# EAGLE design pitanie (EAGLE 9.4.2)
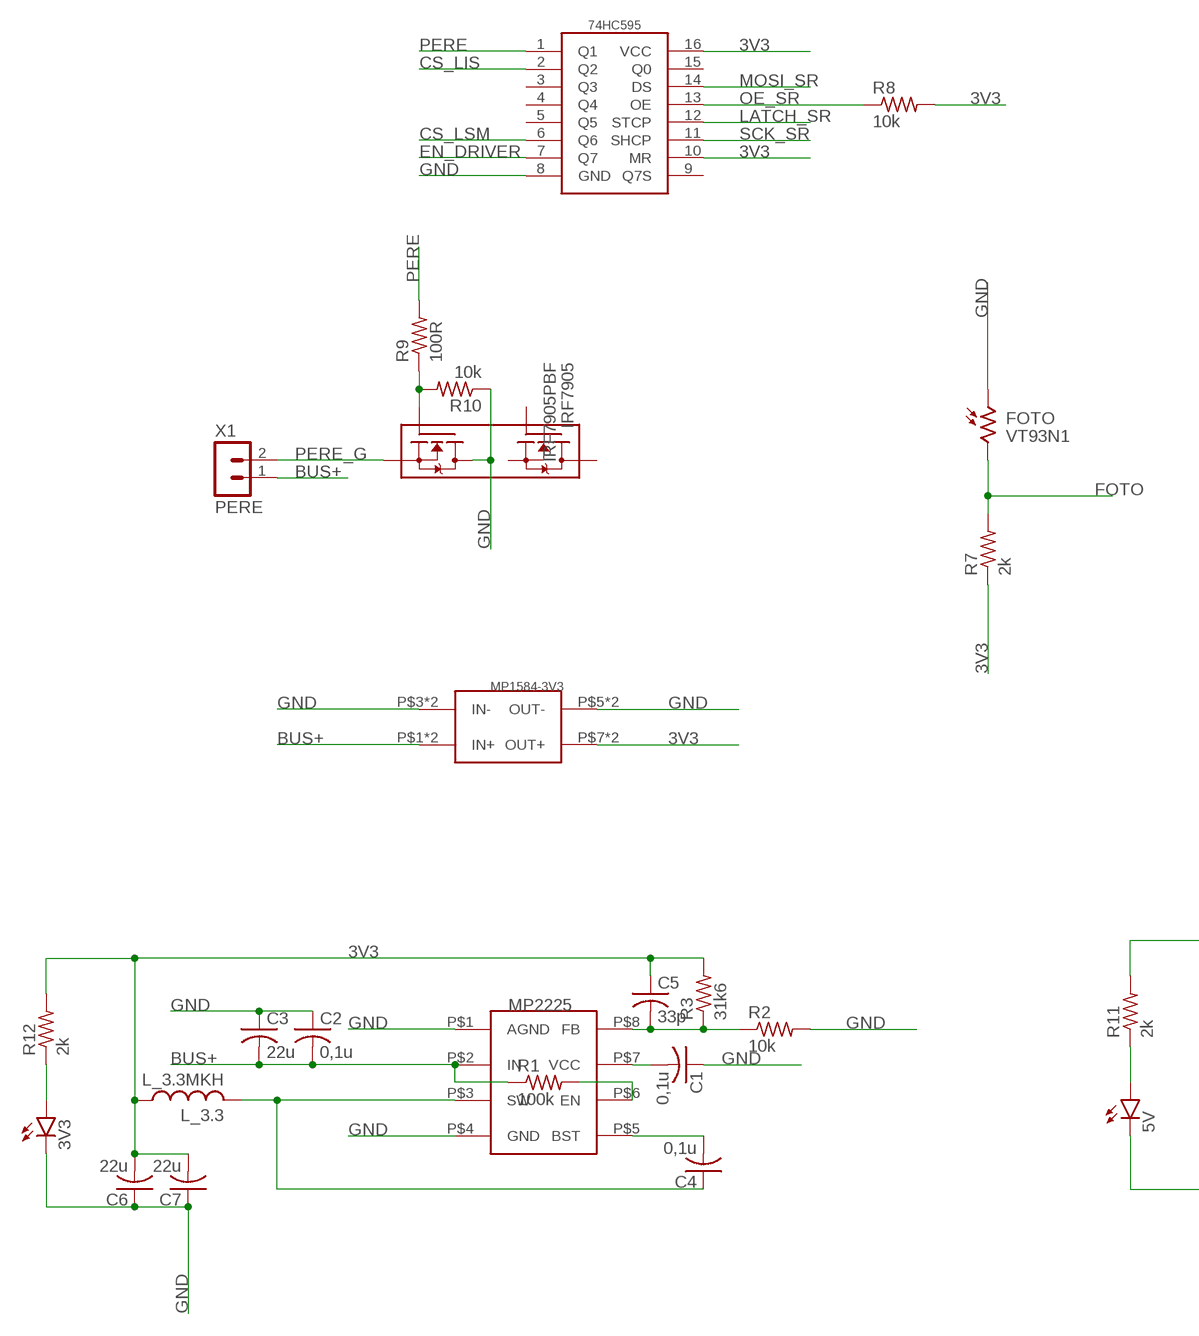
[diagram p0: schematic, sheet 1, part 1 of 2]
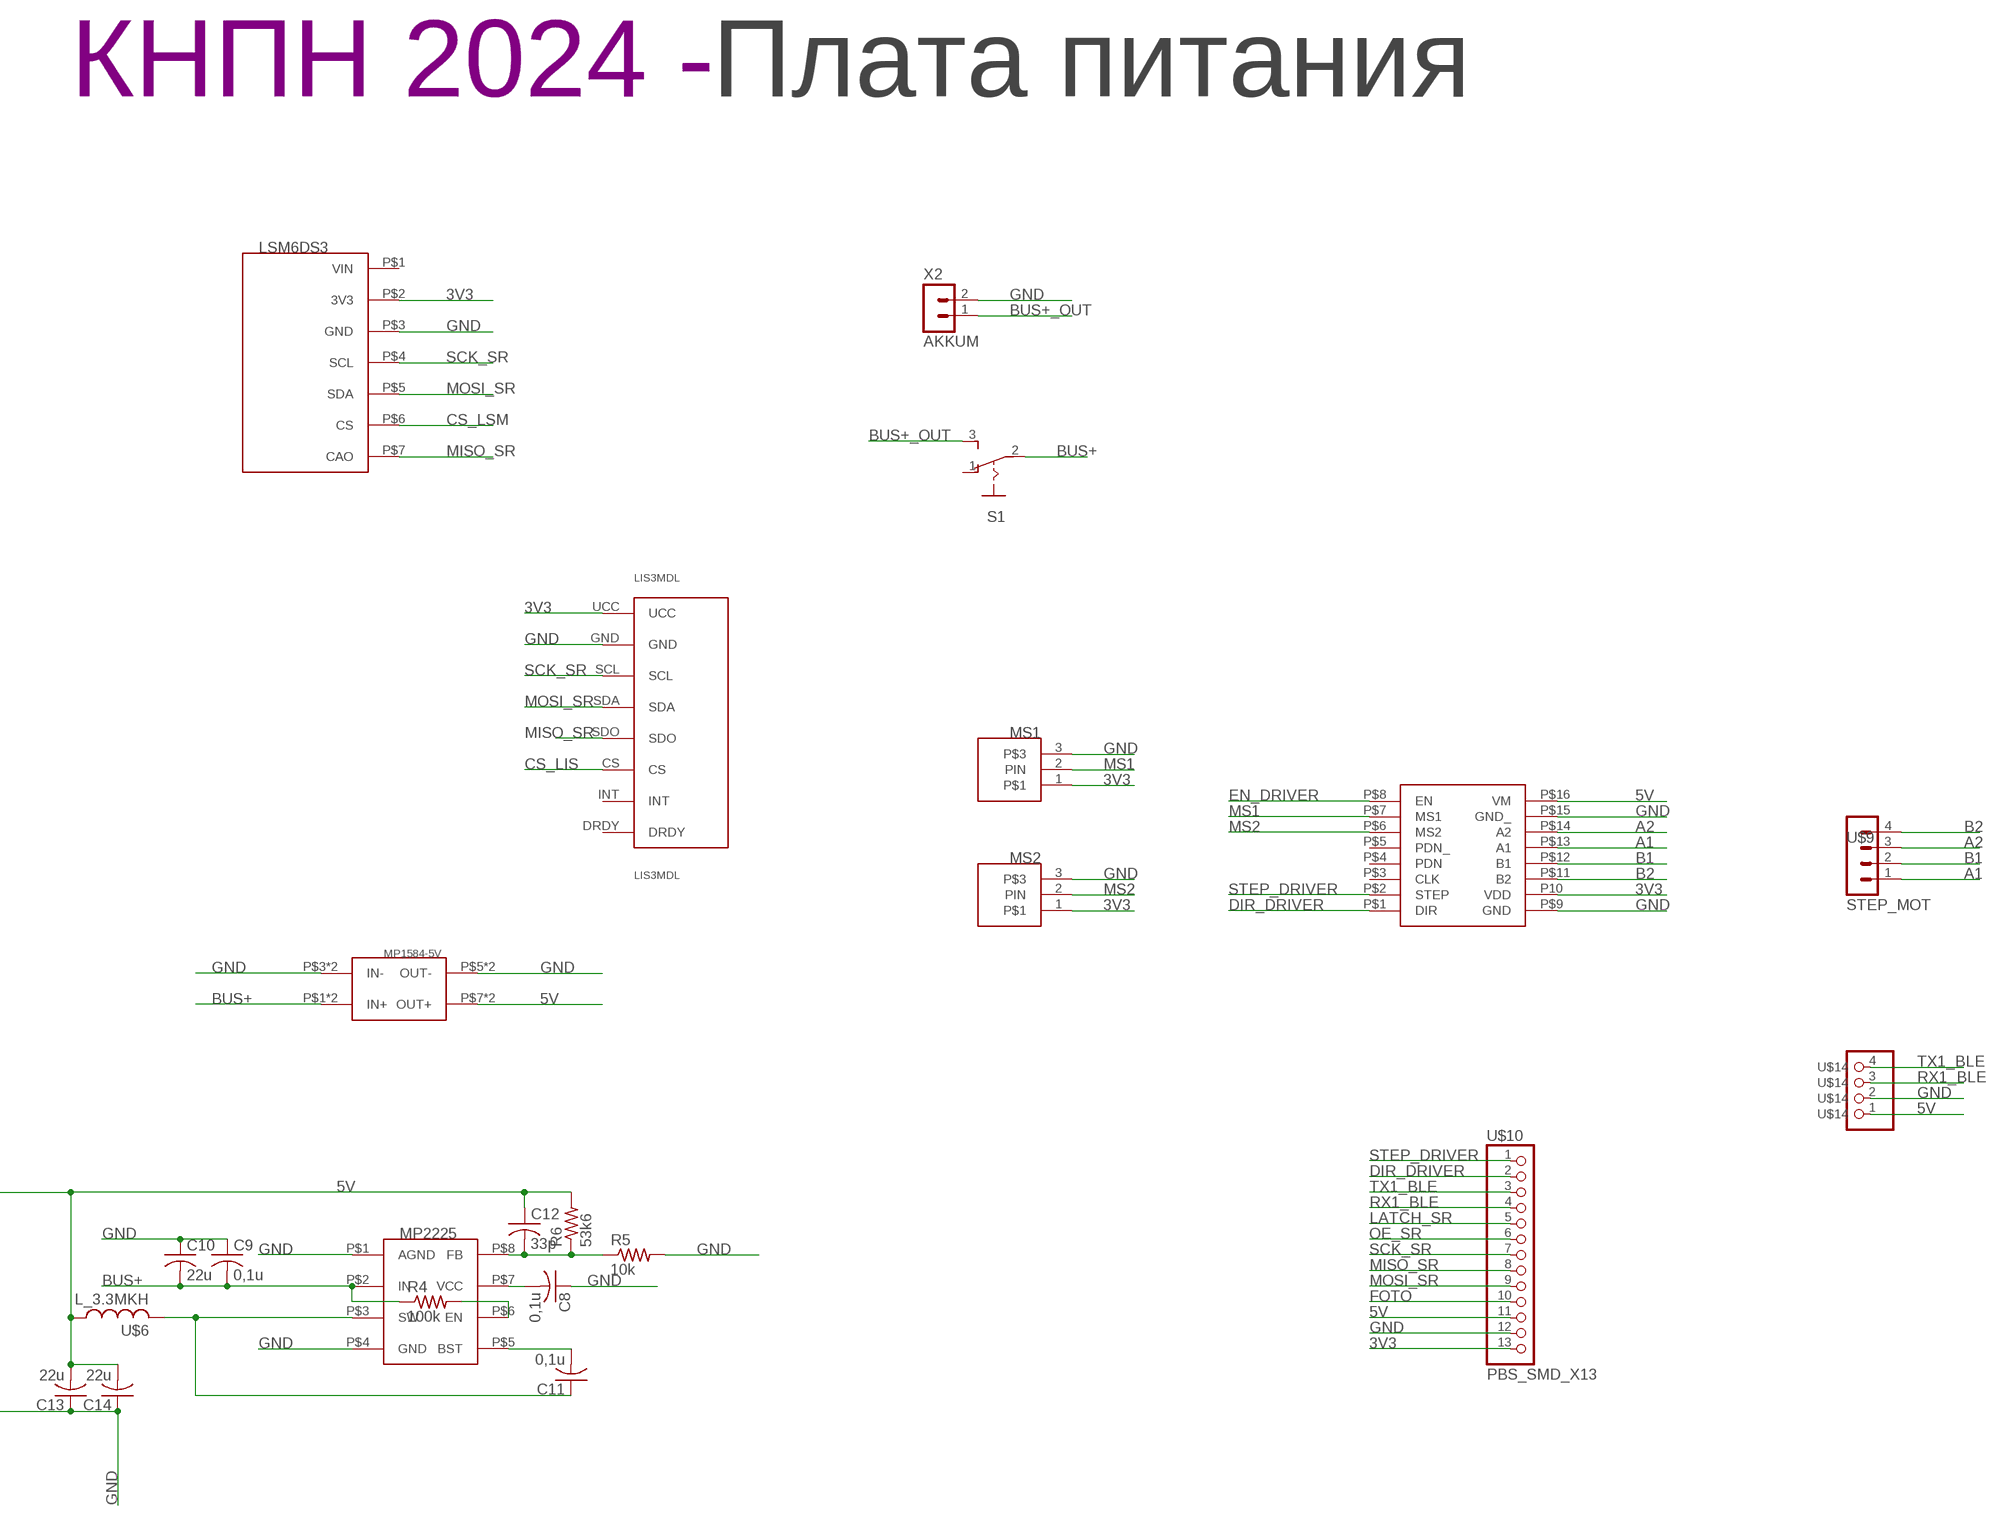
[diagram p1: schematic, sheet 1, part 2 of 2]

## Parts
3V3  LEDCHIP-LED0603  [CHIP-LED0603]
5V  LEDCHIP-LED0603  [CHIP-LED0603]
74HC595  74HC595  [TSSOP16]
C1  0,1u  C-USC0603  [C0603]
C2  0,1u  C-USC1206  [C1206]
C3  22u  C-USC0603  [C0603]
C4  0,1u  C-USC0603  [C0603]
C5  33p  C-USC0603  [C0603]
C6  22u  C-USC1206  [C1206]
C7  22u  C-USC1206  [C1206]
C8  0,1u  C-USC0603  [C0603]
C9  0,1u  C-USC1206  [C1206]
C10  22u  C-USC0603  [C0603]
C11  0,1u  C-USC0603  [C0603]
C12  33p  C-USC0603  [C0603]
C13  22u  C-USC1206  [C1206]
C14  22u  C-USC1206  [C1206]
DRIVER  TMC2209_WITHOUT  [TMC2209_WITHOUT]
FOTO  VT93N1  [VT93N1]
IRF7905  IRF7905PBF  [SO8]
L_3.3  L_3.3MKH  L_3.3MKH_5X5  [L_SPM5020]
LIS3MDL  LIS3MDL  [LIS3MDL]
LSM6DS3  LSM6DS3_WITHOUT  [LSM6DS3_WITHOUT]
MP1584-3V3  MP1584-B  [MP1584-B]
MP1584-5V  MP1584  MP1584-B  [MP1584-B]
MS1  CONNECT_3  [CONNECT_3]
MS2  CONNECT_3  [CONNECT_3]
R1  100k  R-US_R0603  [R0603]
R2  10k  R-US_R0603  [R0603]
R3  31k6  R-US_R0603  [R0603]
R4  100k  R-US_R0603  [R0603]
R5  10k  R-US_R0603  [R0603]
R6  53k6  R-US_R0603  [R0603]
R7  2k  R-US_R0603  [R0603]
R8  10k  R-US_R0603  [R0603]
R9  100R  R-US_R0603  [R0603]
R10  10k  R-US_R0603  [R0603]
R11  2k  R-US_R0603  [R0603]
R12  2k  R-US_R0603  [R0603]
S1  UNICS-SWITCHSS_12D11  [SS_12D11]
U$1  Плата питания  LOGOPCB-""  [LOGO]
U$2  MP2225  [TSOT23-8]
U$5  MP2225  [TSOT23-8]
U$6  L_3.3MKH  L_3.3MKH_5X5  [L_SPM5020]
U$9  STEP_MOT  JST-4-2.5  [JST-4-2.5]
U$10  PBS_SMD_X13  [PBD_SMD_X13]
U$14  BLUETOOTH  MOLEX-4-1.25  [53047-04]
X1  PERE  JST-2-2.5  [JST-2-2.5]
X2  AKKUM  JST-2-2.5  [JST-2-2.5]

## Nets
3V3: 74HC595.10(MR) 74HC595.16(VCC) C5.1 C6.2 C7.2 DRIVER.P10(VDD) L_3.3.P$1 LIS3MDL.UCC LSM6DS3.P$2(3V3) MP1584-3V3.P$7(OUT+) MP1584-3V3.P$8(OUT+) MS1.1 MS2.1 R3.2 R7.1 R8.2 R12.2 U$10.13
5V: C12.1 C13.2 C14.2 DRIVER.P$16(VM) MP1584-5V.P$7(OUT+) MP1584-5V.P$8(OUT+) R6.2 R11.2 U$6.P$1 U$10.11 U$14.1
A1: DRIVER.P$13(A1) U$9.1
A2: DRIVER.P$14(A2) U$9.3
B1: DRIVER.P$12(B1) U$9.2
B2: DRIVER.P$11(B2) U$9.4
BUS+: C2.2 C3.2 C9.2 C10.2 MP1584-3V3.P$1(IN+) MP1584-3V3.P$2(IN+) MP1584-5V.P$1(IN+) MP1584-5V.P$2(IN+) R1.1 R4.1 S1.2(P) U$2.P$2(IN) U$5.P$2(IN) X1.1
BUS+_OUT: S1.3(S) X2.1
CS_LIS: 74HC595.2(Q2) LIS3MDL.CS
CS_LSM: 74HC595.6(Q6) LSM6DS3.P$6(CS)
DIR_DRIVER: DRIVER.P$1(DIR) U$10.2
EN_DRIVER: 74HC595.7(Q7) DRIVER.P$8(EN)
FOTO: FOTO.P$2 R7.2 U$10.10
GND: 3V3.C 5V.C 74HC595.8(GND) C1.1 C2.1 C3.1 C6.1 C7.1 C8.1 C9.1 C10.1 C13.1 C14.1 DRIVER.P$9(GND) DRIVER.P$15(GND_) FOTO.P$1 IRF7905.7(D2) IRF7905.8(D2) LIS3MDL.GND LSM6DS3.P$3(GND) MP1584-3V3.P$3(IN-) MP1584-3V3.P$4(IN-) MP1584-3V3.P$5(OUT-) MP1584-3V3.P$6(OUT-) MP1584-5V.P$3(IN-) MP1584-5V.P$4(IN-) MP1584-5V.P$5(OUT-) MP1584-5V.P$6(OUT-) MS1.3 MS2.3 R2.2 R5.2 R10.1 U$2.P$1(AGND) U$2.P$4(GND) U$5.P$1(AGND) U$5.P$4(GND) U$10.12 U$14.2 X2.2
LATCH_SR: 74HC595.12(STCP) U$10.5
MISO_SR: LIS3MDL.SDO LSM6DS3.P$7(CAO) U$10.8
MOSI_SR: 74HC595.14(DS) LIS3MDL.SDA LSM6DS3.P$5(SDA) U$10.9
MS1: DRIVER.P$7(MS1) MS1.2(PIN)
MS2: DRIVER.P$6(MS2) MS2.2(PIN)
N$1: C1.2 U$2.P$7(VCC)
N$2: R1.2 U$2.P$6(EN)
N$3: C4.2 U$2.P$5(BST)
N$4: C4.1 L_3.3.P$2 U$2.P$3(SW)
N$5: C5.2 R2.1 R3.1 U$2.P$8(FB)
N$6: IRF7905.2(G2) R9.1 R10.2
N$7: C8.2 U$5.P$7(VCC)
N$8: R4.2 U$5.P$6(EN)
N$9: C11.2 U$5.P$5(BST)
N$10: C11.1 U$5.P$3(SW) U$6.P$2
N$11: C12.2 R5.1 R6.1 U$5.P$8(FB)
N$12: 5V.A R11.1
N$13: 3V3.A R12.1
OE_SR: 74HC595.13(OE) R8.1 U$10.6
PERE: 74HC595.1(Q1) R9.2
PERE_G: IRF7905.1(S2) X1.2
RX1_BLE: U$10.4 U$14.3
SCK_SR: 74HC595.11(SHCP) LIS3MDL.SCL LSM6DS3.P$4(SCL) U$10.7
STEP_DRIVER: DRIVER.P$2(STEP) U$10.1
TX1_BLE: U$10.3 U$14.4
Unconnected: 74HC595.3(Q3) 74HC595.4(Q4) 74HC595.5(Q5) 74HC595.9(Q7S) 74HC595.15(Q0) DRIVER.P$3(CLK) DRIVER.P$4(PDN) DRIVER.P$5(PDN_) IRF7905.3(S1) IRF7905.4(G1) IRF7905.5(D1) IRF7905.6(D1) LIS3MDL.DRDY LIS3MDL.INT LSM6DS3.P$1(VIN) S1.1(O)

## Library data of the parts
3V3 5V = led:LED: LED OSRAM: - CHIPLED LG R971, LG N971, LY N971, LG Q971, LY Q971, LO R971, LY R971 LH N974, LH R974 LS Q976, LO Q976, LY Q976 LO Q996 - Hyper CHIPLED LW Q18S LB Q993, LB Q99A, LB R99A - SideLED LS A670, LO A670, LY A670, LG A670, LP A670 LB A673, LV A673, LT A673, LW A673 LH A674 LY A675 LS A676, LA A676, LO A676, LY A676, LW A676 LS A679, LY A679, LG A679 - Hyper Micro SIDELED® LS Y876, LA Y876, LO Y876, LY Y876 LT Y87S - SmartLED LW L88C, LW L88S LB L89C, LB L89S, LG L890 LS L89K, LO L89K, LY L89K LS L896, LA L896, LO L896, LY L896 - TOPLED LS T670, LO T670, LY T670, LG T670, LP T670 LSG T670, LSP T670, LSY T670, LOP T670, LYG T670 LG T671, LOG T671, LSG T671 LB T673, LV T673, LT T673, LW T673 LH T674 LS T676, LA T676, LO T676, LY T676, LB T676, LH T676, LSB T676, LW T676 LB T67C, LV T67C, LT T67C, LS T67K, LO T67K, LY T67K, LW E67C LS E67B, LA E67B, LO E67B, LY E67B, LB E67C, LV E67C, LT E67C LW T67C LS T679, LY T679, LG T679 LS T770, LO T770, LY T770, LG T770, LP T770 LB T773, LV T773, LT T773, LW T773 LH T774 LS E675, LA E675, LY E675, LS T675 LS T776, LA T776, LO T776, LY T776, LB T776 LHGB T686 LT T68C, LB T68C - Hyper Mini TOPLED® LB M676 - Mini TOPLED Santana® LG M470 LS M47K, LO M47K, LY M47K Source: http://www.osram.convergy.de LUXEON: - LUMILED® LXK2-PW12-R00, LXK2-PW12-S00, LXK2-PW14-U00, LXK2-PW14-V00 LXK2-PM12-R00, LXK2-PM12-S00, LXK2-PM14-U00 LXK2-PE12-Q00, LXK2-PE12-R00, LXK2-PE12-S00, LXK2-PE14-T00, LXK2-PE14-U00 LXK2-PB12-K00, LXK2-PB12-L00, LXK2-PB12-M00, LXK2-PB14-N00, LXK2-PB14-P00, LXK2-PB14-Q00 LXK2-PR12-L00, LXK2-PR12-M00, LXK2-PR14-Q00, LXK2-PR14-R00 LXK2-PD12-Q00, LXK2-PD12-R00, LXK2-PD12-S00 LXK2-PH12-R00, LXK2-PH12-S00 LXK2-PL12-P00, LXK2-PL12-Q00, LXK2-PL12-R00 Source: www.luxeon.com KINGBRIGHT: KA-3528ASYC Source: www.kingbright.com
74HC595 = UNKNOWN-2024:74HC595
C1-C14 = rcl:C-US: CAPACITOR, American symbol; SPICEPREFIX: C
DRIVER = UNKNOWN-2024:TMC2209_WITHOUT
FOTO = KNPN-2023:VT93N1
IRF7905 = UNKNOWN-2024:IRF7905PBF
L_3.3 U$6 = CanCubeSat:L_3.3MKH_5X5
LIS3MDL = UNKNOWN-2024:LIS3MDL
LSM6DS3 = UNKNOWN-2024:LSM6DS3_WITHOUT
MP1584-3V3 MP1584-5V = UNKNOWN-2024:MP1584-B
MS1 MS2 = UNKNOWN-2024:CONNECT_3
R1-R12 = rcl:R-US_: RESISTOR, American symbol; SPICEPREFIX: R
S1 = UNKNOWN-2024:UNICS-SWITCH: SLIDING SWITCH Distributor Buerklin, 11G810
U$1 = UNKNOWN-2024:LOGO
U$2 U$5 = UNKNOWN-2024:MP2225
U$9 = UNKNOWN-2024:JST-4-2.5
U$10 = UNKNOWN-2024:PBS_SMD_X13
U$14 = UNKNOWN-2024:MOLEX-4-1.25
X1 X2 = UNKNOWN-2024:JST-2-2.5: JST PH series header 2.00mm pitch disconnectable crimp style connectors, vertical (side entry type), 2 pins

## Board
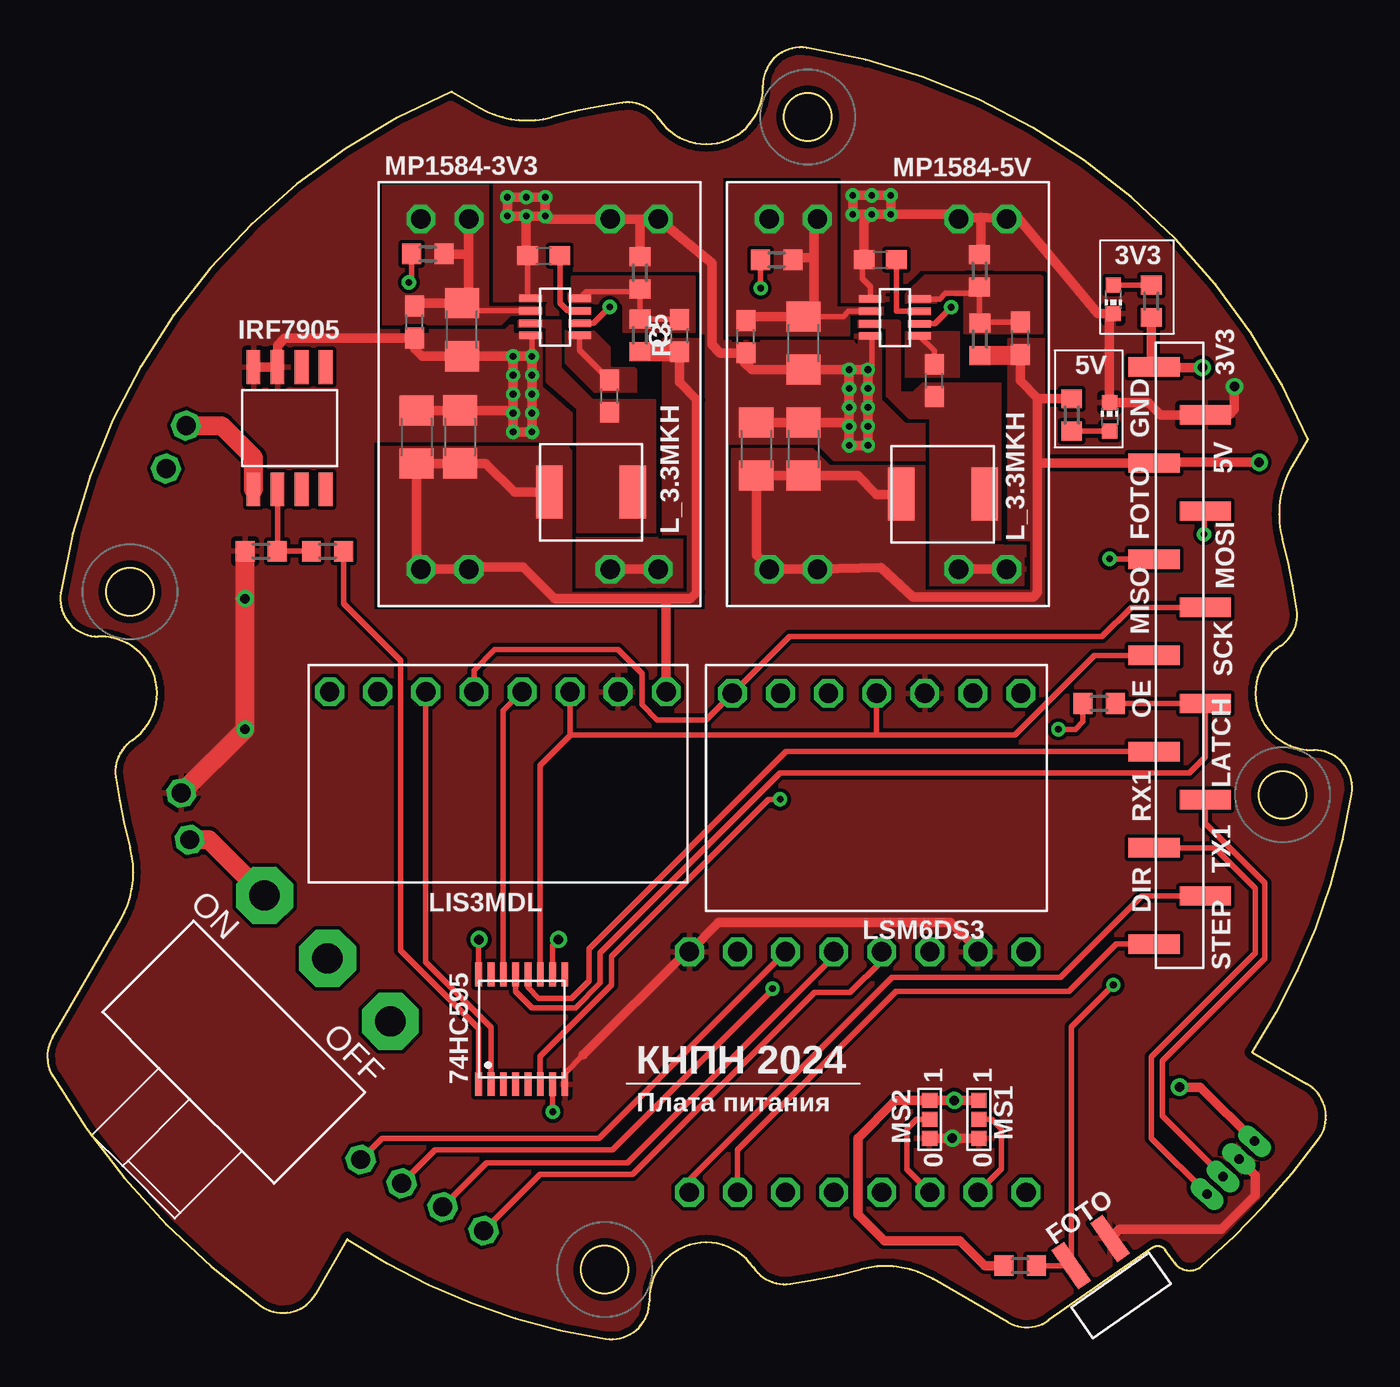
[diagram p2: board, top side]
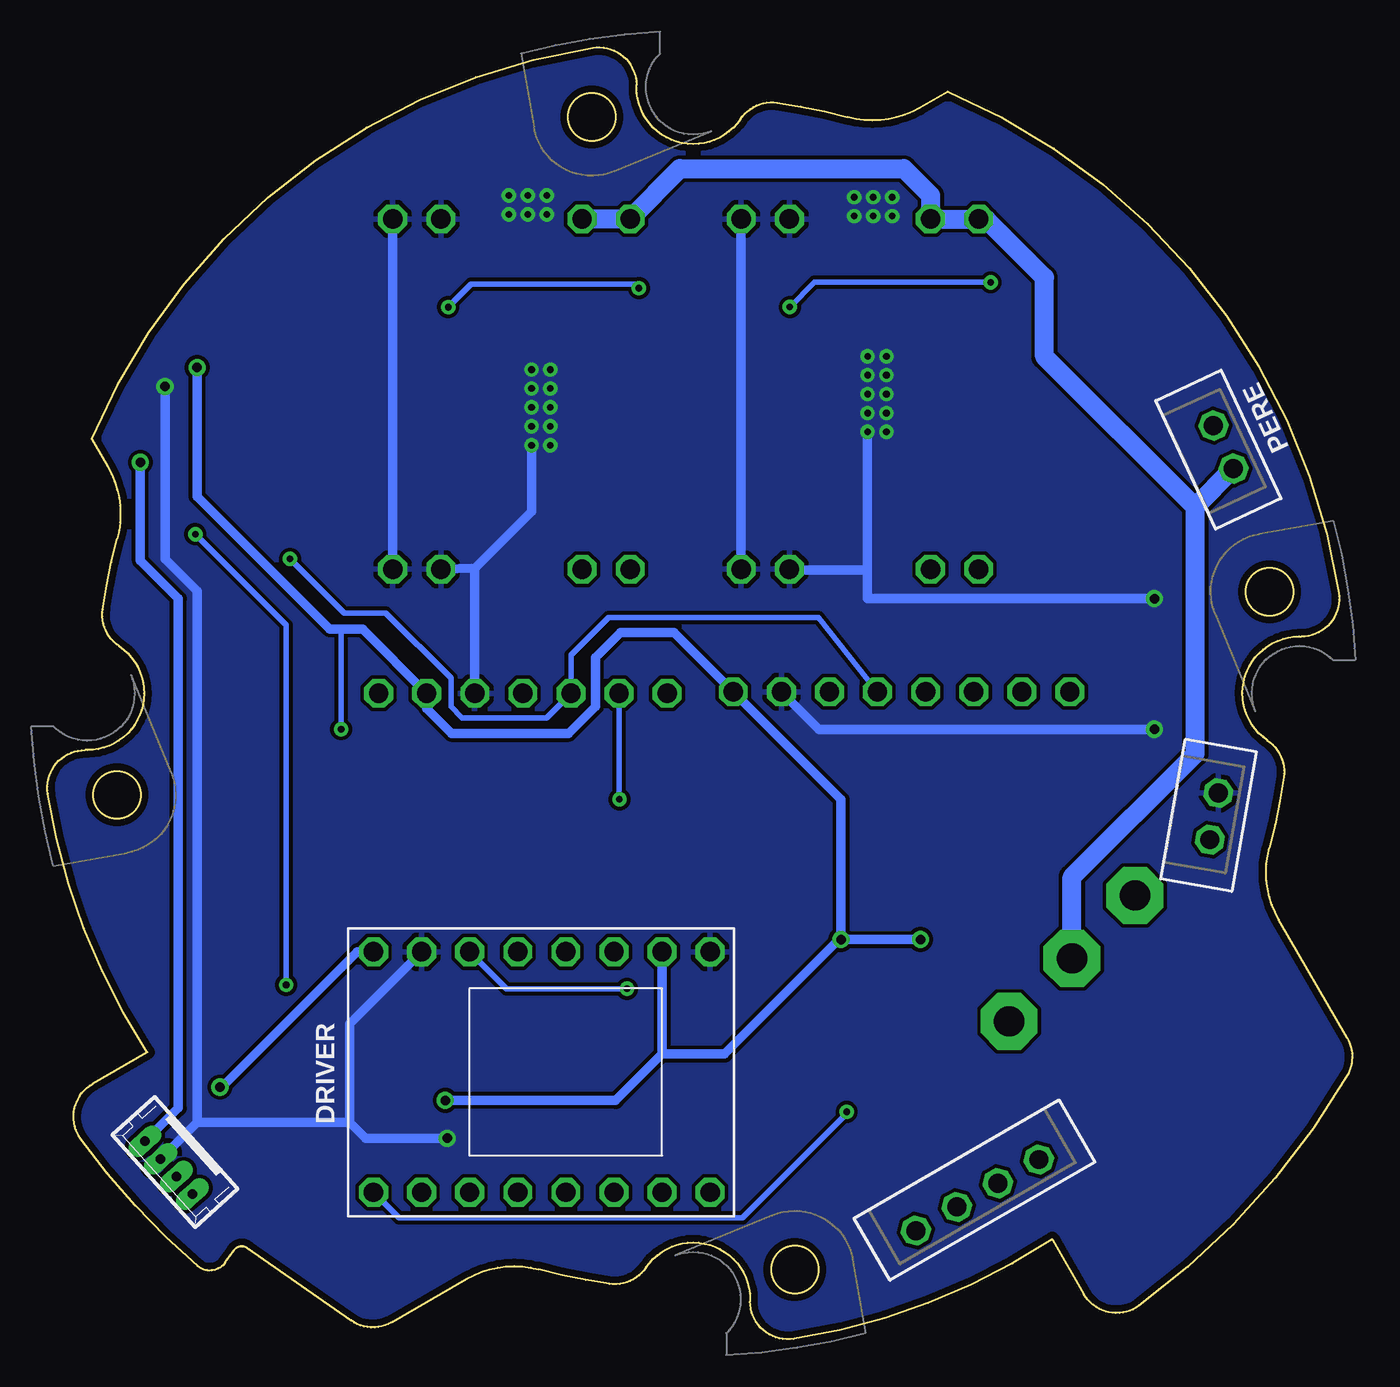
[diagram p3: board, bottom side, seen from below]

Size 68.9 x 68.22 mm. Coordinates in mm from the lower left corner, seen from the top.
Outline: 0.27,15.91 3.87,22.15 arc45 4.37,25.95 arc-7 3.61,29.68 arc-64 4.47,31.62 arc146 2.79,37.11 2.68,37.11 arc-99 0.7,39.42 arc-58 21.36,65.89 22.83,65.03 arc45 26.63,64.54 arc-7 30.37,65.3 arc-64 32.31,64.44 arc146 37.79,66.11 37.79,66.22 arc-99 40.1,68.2 arc-58 66.57,47.55 65.72,46.07 arc45 65.22,42.28 arc-7 65.98,38.54 arc-64 65.12,36.6 arc146 66.79,31.11 66.91,31.11 arc-99 68.88,28.8 arc-24 63.62,15.16 66.52,13.48 arc-96 67.14,10.58 arc-13 60.98,3.87 arc-96 59.5,4.05 59.05,4.7 arc90 58.35,4.83 52.87,0.99 arc-65 50.72,0.9 46.75,3.19 arc45 42.96,3.69 arc-7 39.22,2.92 arc-64 37.28,3.79 arc146 31.79,2.11 31.79,2 arc-99 29.49,0.02 arc-24 15.84,5.28 14.17,2.39 arc-96 11.26,1.77 arc-24 0.27,13.9 arc-60 0.27,15.91
Outline: circle at 29.43,3.68 radius 1.25
Outline: circle at 4.36,39.48 radius 1.25
Outline: circle at 65.22,28.75 radius 1.25
Outline: circle at 40.16,64.54 radius 1.25
Copper layers (1*16): Top 0.035mm / dielectric 1.5mm / Bottom 0.035mm
Design rules "default *": minimum track width 0.3mm, minimum drill 0.35mm, track to track 0.2mm, track to pad 0.2mm, pad to pad 0.2mm, via to via 0.2mm, smd to smd 0.2mm, copper to edge 0.35mm, drill to drill 0.2mm, minimum pad ring 10mil, minimum via ring 8mil, stop-mask expansion 4mil, vias tented up to drill 0mil, thermal gap 10mil

### Footprints (pad centres in the part's own frame; a part is rotated, then mirrored left to right if it is on the bottom)
CHIP-LED0603 = smd 0.8 x 0.8: A 0,-0.75; C 0,0.75
TSSOP16 = smd 1.26 x 0.36: 1 -2.9,2.275; 2 -2.9,1.625; 3 -2.9,0.975; 4 -2.9,0.325; 5 -2.9,-0.325; 6 -2.9,-0.975; 7 -2.9,-1.625; 8 -2.9,-2.275; 9 2.9,-2.275; 10 2.9,-1.625; 11 2.9,-0.975; 12 2.9,-0.325; 13 2.9,0.325; 14 2.9,0.975; 15 2.9,1.625; 16 2.9,2.275
C0603 = smd 1.1 x 1: 1 -0.85,0; 2 0.85,0
C1206 = smd 1.6 x 1.8: 1 -1.4,0; 2 1.4,0
TMC2209_WITHOUT = drill 1.016 octagon: P10 6.35,-6.35; P$1 -6.35,-8.89; P$2 -6.35,-6.35; P$3 -6.35,-3.81; P$4 -6.35,-1.27; P$5 -6.35,1.27; P$6 -6.35,3.81; P$7 -6.35,6.35; P$8 -6.35,8.89; P$9 6.35,-8.89; P$11 6.35,-3.81; P$12 6.35,-1.27; P$13 6.35,1.27; P$14 6.35,3.81; P$15 6.35,6.35; P$16 6.35,8.89
VT93N1 = smd 0.8 x 2.5: P$1 -1.25,-1.8; P$2 1.25,-1.8
SO8 = smd 0.72 x 1.78: 1 -1.905,-3.23; 2 -0.635,-3.23; 3 0.635,-3.23; 4 1.905,-3.23; 5 1.905,3.23; 6 0.635,3.23; 7 -0.635,3.23; 8 -1.905,3.23
L_SPM5020 = smd 1.4 x 2.8: P$1 -2.2,0; P$2 2.2,0
LIS3MDL = drill 1.016 octagon: CS -5.08,-3.81; DRDY -5.08,-8.89; GND -5.08,6.35; INT -5.08,-6.35; SCL -5.08,3.81; SDA -5.08,1.27; SDO -5.08,-1.27; UCC -5.08,8.89
LSM6DS3_WITHOUT = drill 1.016 octagon: P$1 -7.62,-5; P$2 -5.08,-5; P$3 -2.54,-5; P$4 0,-5; P$5 2.54,-5; P$6 5.08,-5; P$7 7.62,-5
MP1584-B = drill 1.016 octagon: P$1 -9.25,-6.27; P$2 -9.25,-3.73; P$3 -9.25,3.73; P$4 -9.25,6.27; P$5 9.25,6.27; P$6 9.25,3.73; P$7 9.25,-3.73; P$8 9.25,-6.27
CONNECT_3 = smd 0.8 x 0.8: 1 1,0; 2 0,0; 3 -1,0
R0603 = smd 1 x 1.1: 1 -0.85,0; 2 0.85,0
SS_12D11 = drill 1.6 pad 3 octagon: 1 -4.7,0; 2 0,0; 3 4.7,0
TSOT23-8 = smd 0.4 x 1.2: P$1 -0.975,-1.3; P$2 -0.325,-1.3; P$3 0.325,-1.3; P$4 0.975,-1.3; P$5 0.975,1.3; P$6 0.325,1.3; P$7 -0.325,1.3; P$8 -0.975,1.3
JST-4-2.5 = drill 1 pad 1.5 octagon: 1 3.75,0; 2 1.25,0; 3 -1.25,0; 4 -3.75,0
PBD_SMD_X13 = smd 1.02 x 2.7: 1 -15.24,1.35; 2 -12.7,-1.35; 3 -10.16,1.35; 4 -7.62,-1.35; 5 -5.08,1.35; 6 -2.54,-1.35; 7 0,1.35; 8 2.54,-1.35; 9 5.08,1.35; 10 7.62,-1.35; 11 10.16,1.35; 12 12.7,-1.35; 13 15.24,1.35
53047-04 = drill 0.5 pad 0.698 long: 1 1.875,0.45; 2 0.625,0.45; 3 -0.625,0.45; 4 -1.875,0.45
JST-2-2.5 = drill 1 pad 1.5 octagon: 1 1.25,0; 2 -1.25,0

### Placement (x,y rotation side)
3V3  56.29,54.91 180 top
5V  56.09,48.71 0 top
74HC595  25.05,16.37 90 top
C1  26.21,57.21 0 top
C2  21.89,53.31 90 top
C3  19.39,53.71 90 top
C4  29.69,49.8 90 top
C5  33.39,52.99 90 top
C6  19.49,47.64 270 top
C7  21.79,47.65 270 top
C8  43.99,57.01 0 top
C9  39.94,52.61 90 top
C10  36.89,52.94 90 top
C11  46.84,50.64 90 top
C12  51.39,52.86 90 top
C13  37.44,47.01 270 top
C14  39.94,47.01 270 top
DRIVER  42.79,14.11 90 bottom
FOTO  56.12,3.13 215 top
IRF7905  12.79,48.11 0 top
L_3.3  28.71,44.73 0 top
LIS3MDL  23.79,29.11 270 top
LSM6DS3  43.79,29.11 180 top
MP1584-3V3  25.99,49.91 270 top
MP1584-5V  44.39,49.91 270 top
MS1  49.19,11.61 90 top
MS2  46.59,11.61 90 top
R1  20.09,57.31 180 top
R2  31.29,56.31 90 top
R3  31.29,53.01 270 top
R4  38.52,57 180 top
R5  49.23,56.42 90 top
R6  49.25,52.81 270 top
R7  51.37,3.89 0 top
R8  55.54,33.57 180 top
R9  14.79,41.61 0 top
R10  11.29,41.61 0 top
R11  54.09,48.81 90 top
R12  58.29,54.81 270 top
S1  14.79,20.11 135 top
U$1  30.59,13.51 0 top
U$2  26.81,53.98 270 top
U$5  44.76,53.96 270 top
U$6  47.29,44.63 0 top
U$9  19.79,7.61 210 bottom
U$10  59.79,36.11 90 top
U$14  62.17,9.36 132 bottom
X1  6.79,47.11 295 bottom
X2  7.29,27.61 260 bottom

### Tracks (layer width: path | path; a pad name or v marks a point on that pad's centre or on a via)
3V3  (via drill 0.35 pad 0.55, 0.5, 0.5 pad 0.55)
  Top 0.3: 33.37,52.16 C5.1 | 74HC595.16 22.78,21.1 v22.79,21.11 | 74HC595.10 26.68,20.8 v26.99,21.11 | R8.2 54.69,32.61 54.29,32.21 v53.39,32.21
  Top 0.5: L_3.3.P$1 24.67,44.73 23.15,46.25 C7.2 C6.2 | C6.2 | 32.69,39.11 26.79,39.11 25.12,40.78 22.41,40.78 MP1584-3V3.P$7 MP1584-3V3.P$8 19.5,40.84 C6.2 | 32.69,39.11 33.97,39.11 34.29,39.43 34.29,49.61 33.37,50.53 33.37,52.16 | v60.99,51.31 58.48,51.31 U$10.13 58.29,51.5 R12.2 | R7.1 49.51,3.89 48.19,5.21 44.19,5.21 42.8,6.61 42.8,10.61 44.79,12.61 MS2.1 v47.89,12.61 MS1.1 | LIS3MDL.UCC 32.68,39.1 32.69,39.11
  Top 1: R3.2 33.37,52.16
  Bottom 0.3: v53.39,32.21 53.39,37.51
  Bottom 0.5: v60.99,51.31 60.99,44.51 53.99,37.51 53.39,37.51 52.26,37.51 52.23,37.47 LSM6DS3.P$2 48.87,33.31 47.56,32 41.37,32 39.95,33.43 39.95,36.01 38.64,37.32 35.82,37.32 LIS3MDL.UCC 26.99,28.5 26.99,21.21 | v22.79,21.11 v26.99,21.11 26.99,21.21 | DRIVER.P10 36.44,15.06 | 36.44,15.06 38.89,12.61 v47.89,12.61 | 36.44,15.06 33.14,15.06 26.99,21.21
  pour Top (no thermals): 27.49,47.11 17.49,47.11 17.49,38.81 34.49,38.81 34.49,52.81 32.49,52.81 32.49,42.51 33.79,42.51 33.79,39.41 27.69,39.41 27.69,46.91
5V  (via drill 0.5 pad 0.55)
  Top 0.5: U$6.P$1 43.79,44.61 42.8,45.6 C14.2 C13.2 37.44,41.42 38.09,40.77 MP1584-5V.P$8 MP1584-5V.P$7 44.03,40.74 45.7,39.2 52.06,39.2 52.29,39.43 52.29,46.31 | 52.29,46.31 52.29,49.71 | C12.1 51.39,50.62 52.29,49.71 | 52.29,46.31 52.33,46.27 U$10.11 58.48,46.31 v63.99,46.31 | v59.79,13.31 60.9,13.31 U$14.1 | R11.2 52.34,49.66 52.29,49.71
  Top 1: C12.1 51.34,51.95 R6.2
  Bottom 0.5: U$14.1 61.99,12.22 61.99,39.11 63.99,41.11 v63.99,46.31 | v59.79,13.31 59.69,13.31 52.54,20.46 DRIVER.P$16
  pour Top (no thermals): 40.44,47.01 36.14,47.01 36.14,38.85 52.66,38.85 52.66,52.81 50.74,52.81 50.74,42.21 51.94,42.21 51.94,39.51 46.34,39.51 46.34,46.11 41.34,46.11
A1
  Top 0.3: U$9.1 26.02,8.71 30.92,8.71 40.52,18.31 42.39,18.31 44.06,19.98 DRIVER.P$13
A2  (via drill 0.35)
  Top 0.3: U$9.3 20.49,10.01 29.86,10.01 38.29,18.45 v38.29,18.51
  Bottom 0.3: v38.29,18.51 44.65,18.51 DRIVER.P$14
B1
  Top 0.3: U$9.2 23.2,9.31 30.63,9.31 41.52,20.2 DRIVER.P$12
B2
  Top 0.3: U$9.4 17.68,10.61 29.13,10.61 DRIVER.P$11
BUS+
  Top 0.3: U$5.P$2 42.31,54.28 42.04,54 C9.2 | U$2.P$2 22.3,54.31 C2.2
  Top 0.5: C3.2 19.54,54.71 C2.2 22.24,55.06 22.24,57.3 | MP1584-3V3.P$2 22.24,59.12 22.24,57.3 | R1.1 22.23,57.31 22.24,57.3 | C10.2 37.11,54 C9.2 40.49,54.55 40.49,57.11 | MP1584-5V.P$2 40.49,59.47 40.49,57.11 | R4.1 39.48,57.11 40.49,57.11
  Bottom 1: S1.2 14.79,24.41 8.29,30.91 8.29,43.95 | 8.29,43.95 X1.1 | MP1584-5V.P$2 MP1584-5V.P$1 35.51,61.83 23.68,61.83 22.25,60.4 MP1584-3V3.P$2 MP1584-3V3.P$1 19.31,59.13 16.24,56.06 16.24,51.9 8.29,43.95
  pour Top (no thermals): 23.29,60.91 17.69,60.91 17.69,53.61 23.99,53.61 24.49,54.11 26.09,54.11 26.09,54.51 23.29,54.51
  pour Top (no thermals): 44.14,54.51 44.14,54.11 42.34,54.11 42.34,53.01 35.94,53.01 35.94,61.11 41.64,61.11 41.64,54.51
BUS+_OUT
  Top 1: X2.1 8.52,26.38 S1.3
CS_LIS
  Top 0.3: 74HC595.2 23.43,16.48 19.98,19.92 LIS3MDL.CS
CS_LSM  (via drill 0.35)
  Top 0.3: 74HC595.6 26.03,14.95 28.09,17.01 28.11,17.01 29.8,18.7 29.8,20.22 38.09,28.51 v38.69,28.51
  Bottom 0.3: LSM6DS3.P$6 38.71,28.53 v38.69,28.51
DIR_DRIVER
  Top 0.3: U$10.2 57.79,23.41 53.49,19.11 44.59,19.11 33.9,8.42 DRIVER.P$1
EN_DRIVER  (via drill 0.35)
  Top 0.3: v26.69,12.01 26.68,12.03 74HC595.7
  Bottom 0.3: DRIVER.P$8 50.33,6.41 32.19,6.41 26.69,11.91 v26.69,12.01
FOTO  (via drill 0.35)
  Top 0.3: R7.2 FOTO.P$2 54.07,16.49 v56.29,18.71 | U$10.10 61.09,43.68 v61.09,42.51
  Bottom 0.3: v56.29,18.71 56.29,37.71 v61.09,42.51
GND  (via drill 0.35, 0.5, 0.5 pad 0.55)
  Top 0.3: U$2.P$1 25.36,55.11 C1.1 | v43.34,51.2 43.56,51.42 43.56,52.88 U$5.P$4 | U$5.P$1 43.46,55.58 43.04,56 43.04,56.9 C8.1 | U$2.P$4 25.59,52.93 v25.59,51.91 | 74HC595.8 27.33,14.05 28.29,15.01
  Top 0.5: C6.1 C7.1 24.45,49.05 v24.59,48.91 | v24.59,48.91 v24.59,47.91 v25.59,47.91 v25.59,48.91 v25.59,49.91 v25.59,50.91 v25.59,51.91 v24.59,51.91 | v24.59,48.91 v24.59,49.91 v24.59,50.91 v24.59,51.91 | v24.59,51.91 C2.1 19.79,51.91 19.39,52.31 C3.1 12.54,52.86 12.16,52.48 IRF7905.7 IRF7905.8 | C1.1 25.29,57.28 v25.29,59.31 | v25.29,59.31 v24.29,59.31 v24.29,60.31 v25.29,60.31 v26.29,60.31 v26.29,59.31 | v25.29,59.31 v26.29,59.31 | MP1584-3V3.P$5 MP1584-3V3.P$6 | C13.1 C14.1 42.14,48.4 v42.34,48.2 | v42.34,51.2 C9.1 37.2,51.2 36.79,51.61 36.79,51.99 C10.1 35.52,52.08 35.09,52.51 35.09,56.83 MP1584-3V3.P$4 31.29,59.16 | v42.34,48.2 v42.34,47.2 v43.34,47.2 v43.34,48.2 v43.34,49.2 v43.34,50.2 v43.34,51.2 v42.34,51.2 | v42.34,48.2 v42.34,49.2 v42.34,50.2 v42.34,51.2 | C8.1 43.14,59 v43.54,59.4 | v43.54,59.4 v42.54,59.4 v42.54,60.4 v43.54,60.4 v44.54,60.4 v44.54,59.4 | v43.54,59.4 v44.54,59.4 | U$14.2 63.79,8.65 63.79,7.61 61.99,5.81 56.6,5.81 FOTO.P$1 | v62.69,50.31 62.69,49.11 62.39,48.81 U$10.12 58.79,48.81 58.14,49.46 5V.C 56.09,53.96 3V3.C 55.49,54.16 51.27,59.22 50.65,59.22 MP1584-5V.P$4 49.29,59.24 | MP1584-5V.P$6 MP1584-5V.P$5 | v44.54,59.4 47.93,59.4 MP1584-5V.P$3 49.29,59.24 | 49.29,59.24 49.29,57.33 R5.2 | 28.29,15.01 33.74,20.46 DRIVER.P$9 35.45,22.01 47.69,22.01 49.14,20.56 DRIVER.P$15 | MS2.3 v47.79,10.61 MS1.3 | 31.29,59.16 MP1584-3V3.P$3 26.44,59.16 v26.29,59.31 | R2.2 31.29,59.16
  Top 1: R10.1 v10.44,39.11 v10.44,32.21 X2.2
  Bottom 0.5: MP1584-3V3.P$5 MP1584-3V3.P$4 | U$14.2 60.99,11.45 | 60.99,11.45 60.99,39.51 62.69,41.21 v62.69,50.31 | v43.34,47.2 43.34,43.71 46.3,40.75 46.3,40.72 | MP1584-5V.P$5 MP1584-5V.P$4 | v10.44,39.11 25.59,39.11 25.59,40.61 | MP1584-5V.P$6 46.3,40.72 | v25.59,47.91 25.59,40.61 | MP1584-3V3.P$6 29.69,40.61 25.59,40.61 | DRIVER.P$15 52.94,16.66 52.94,11.45 | 52.94,11.45 60.99,11.45 | 52.94,11.45 52.1,10.61 v47.79,10.61 | LSM6DS3.P$3 46.33,40.68 46.3,40.72 | LIS3MDL.GND 28.16,32.21 v10.44,32.21
  pour Top (no thermals): 33.29,41.91 33.29,39.71 28.49,39.71 28.49,41.91
  pour Top (no thermals): 34.19,56.41 27.99,56.41 27.99,58.11 26.39,58.11 26.39,54.81 23.59,54.81 23.59,60.91 34.19,60.91
  pour Top (no thermals): 27.59,47.41 17.79,47.41 17.79,53.11 26.09,53.11 26.09,50.21 27.59,48.71
  pour Top (no thermals): 51.54,39.81 46.64,39.81 46.64,41.81 51.54,41.81
  pour Top (no thermals): 52.54,56.51 52.54,61.11 41.94,61.11 41.94,54.81 44.24,54.81 44.24,55.21 44.04,55.41 44.04,58.01 46.14,58.01 46.14,56.51
  pour Top (no thermals): 44.04,53.11 42.84,53.11 42.84,52.41 38.04,52.41 38.04,52.61 35.94,52.61 35.94,47.31 41.74,47.31 41.74,46.81 44.04,46.81
  pour Top (rank 2): -10.61,71.81 -10.61,-5.59 76.79,-5.59 76.79,71.81
  pour Bottom (rank 2): -9.81,71.11 -9.81,-4.79 76.19,-4.79 76.19,71.11
LATCH_SR
  Top 0.3: 74HC595.12 25.38,18.57 25.94,18.01 27.69,18.01 28.59,18.91 28.59,20.61 39.01,31.03 U$10.5
MISO_SR
  Top 0.3: LIS3MDL.SDO 22.52,35.31 23.62,36.41 30.13,36.41 31.39,35.14 31.39,33.51 32.19,32.71 34.77,32.71 LSM6DS3.P$7 36.19,34.11 39.19,37.11 55.69,37.11 57.23,38.65 U$10.8
MOSI_SR  (via drill 0.35)
  Top 0.3: v56.09,41.21 58.42,41.21 U$10.9 | LIS3MDL.SDA 24.08,33.21 74HC595.14
  Bottom 0.3: v56.09,41.21 53.24,38.36 51.04,38.36 47.59,34.91 47.59,33.41 46.99,32.81 42.55,32.81 LSM6DS3.P$5 41.25,36.13 39.27,38.11 28.18,38.11 LIS3MDL.SDA
MS1
  Top 0.3: MS1.2 49.89,11.61 50.39,11.11 50.39,9.01 DRIVER.P$7
MS2
  Top 0.3: MS2.2 45.89,11.61 45.39,11.11 45.39,8.97 DRIVER.P$6
N$1
  Top 0.3: C1.2 27.06,54.71 27.47,54.31 U$2.P$7
N$2  (via drill 0.35)
  Top 0.3: R1.2 19.24,55.96 v19.09,55.81 | v29.69,54.51 28.84,53.66 U$2.P$6
  Bottom 0.3: v19.09,55.81 28.39,55.81 v29.69,54.51
N$3
  Top 0.3: C4.2 28.11,52.23 U$2.P$5
  pour Top (no thermals): 31.09,50.01 28.89,50.01 27.39,51.51 27.39,53.31 28.79,53.31 29.69,52.41 29.69,51.41 29.79,51.31 30.99,51.31 31.09,51.21
N$4
  pour Top (no thermals): 32.09,42.61 27.99,42.61 27.99,49.11 26.39,50.51 26.39,53.41 24.89,53.41 24.89,53.81 27.09,53.81 27.09,51.31 28.79,49.61 32.09,49.61
N$5
  Top 0.3: U$2.P$8 28.47,55.31 31.14,55.31 R2.1 31.29,54.31 31.49,54.11 31.49,54.06 R3.1 33.37,53.86 C5.2
  pour Top (no thermals): 34.19,53.21 34.19,56.11 27.69,56.11 27.69,55.41 27.49,55.21 27.49,54.71 29.09,54.71 29.29,54.91 30.09,54.91 30.39,54.61 30.39,53.21
N$6
  Top 0.3: IRF7905.2 12.16,41.63 R10.2 R9.1
N$7
  Top 0.3: C8.2 44.84,54.3 44.86,54.28 U$5.P$7
N$8  (via drill 0.35)
  Top 0.3: R4.2 v37.67,55.5 | v47.74,54.5 46.86,53.63 U$5.P$6
  Bottom 0.3: v37.67,55.5 37.87,55.7 46.54,55.7 v47.74,54.5
N$9
  Top 0.3: C11.2 46.84,52.2 U$5.P$5
  pour Top (no thermals): 48.14,50.81 45.34,50.81 45.34,53.21 48.14,53.21
N$10
  pour Top (no thermals): 50.34,42.21 46.64,42.21 46.64,48.61 45.54,48.61 44.34,49.81 44.34,53.41 42.84,53.41 42.84,53.81 44.94,53.81 45.04,53.71 45.04,50.01 45.74,50.01 46.24,50.51 50.34,50.51
N$11
  Top 0.3: U$5.P$8 47.13,54.93 47.43,55.23 48.89,55.23 R5.1 49.23,53.67 R6.1 49.3,53.7 C12.2
  pour Top (no thermals): 52.54,53.11 48.44,53.11 48.44,55.11 46.94,55.11 46.94,54.71 45.34,54.71 45.34,55.21 46.34,56.21 52.44,56.21 52.54,56.11
N$12
  Top 0.3: R11.1 5V.A
N$13
  Top 0.3: R12.1 3V3.A
OE_SR
  Top 0.3: 74HC595.13 24.73,18.38 25.59,17.51 27.9,17.51 29.2,18.81 29.2,20.41 38.7,29.91 60.29,29.91 61.14,30.76 U$10.6 R8.1
PERE
  Top 0.3: 74HC595.1 22.78,16.42 18.66,20.54 18.66,35.85 15.64,38.86 R9.2
PERE_G
  Top 1: IRF7905.1 10.89,46.55 9.19,48.24 X1.2
RX1_BLE
  Top 0.3: U$14.3 58.89,11.79 58.89,14.71 64.29,20.11 64.29,24.09 61.14,27.24 U$10.4
SCK_SR
  Top 0.3: 74HC595.11 26.03,30.31 27.63,31.91 | U$10.7 55.29,36.11 51.09,31.91 43.79,31.91 | 43.79,31.91 27.63,31.91 | LIS3MDL.SCL 27.6,31.94 27.63,31.91 | LSM6DS3.P$4 43.79,31.91
STEP_DRIVER
  Top 0.3: U$10.1 56.45,20.87 53.94,18.36 44.81,18.36 36.44,9.99 DRIVER.P$2
TX1_BLE
  Top 0.3: U$14.4 58.29,10.62 58.29,14.91 63.79,20.41 63.79,23.81 61.66,25.95 U$10.3
(copper drawn outside any net)
  shapes: Route13 circle x1

### Text on the board
tNames: 3V3 | GND | 5V | FOTO | MOSI | MISO | SCK | OE | LATCH | RX1 | TX1 | DIR | STEP
bNames: PERE